# EAGLE schematic DIY_OpenEVSE_PLUS_30A (EAGLE 9.6.2)
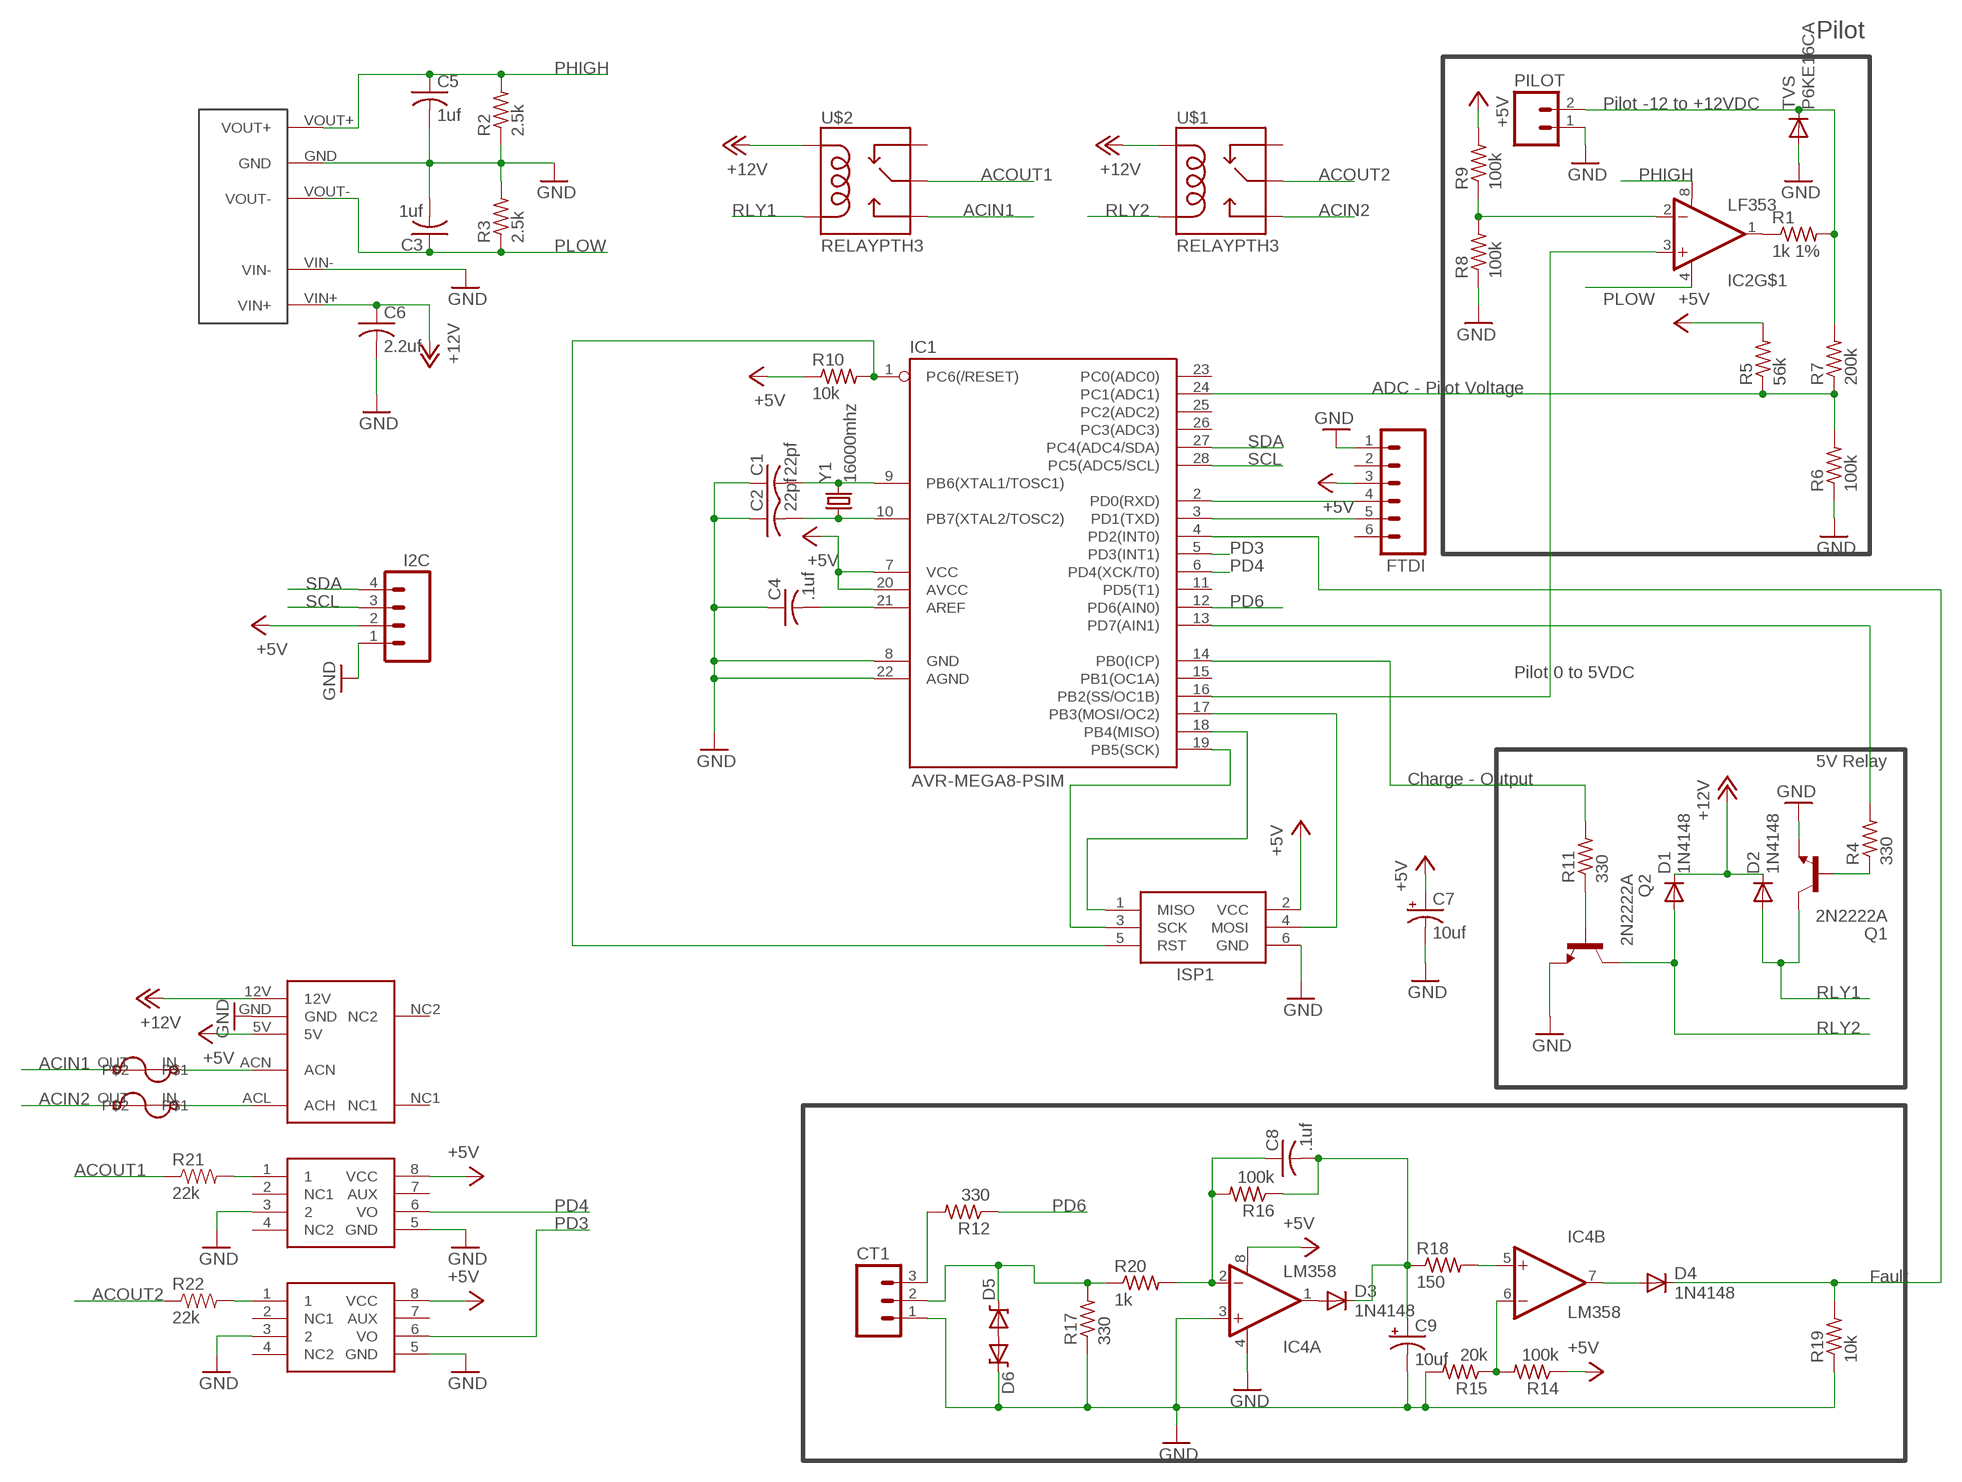
[diagram p0: schematic, sheet 1]

## Parts
C1  22pf  C-US025-024X044  [C025-024X044]
C2  22pf  C-US025-024X044  [C025-024X044]
C3  1uf  C-US025-024X044  [C025-024X044]
C4  .1uf  C-US025-024X044  [C025-024X044]
C5  1uf  C-US025-024X044  [C025-024X044]
C6  2.2uf  C-US025-024X044  [C025-024X044]
C7  10uf  CAP_POLPTH2  [CPOL-RADIAL-10UF-25V]
C8  .1uf  C-US025-024X044  [C025-024X044]
C9  10uf  CAP_POLPTH2  [CPOL-RADIAL-10UF-25V]
CT1  M03LOCK  [1X03_LOCK]
D1  1N4148  DIODE1N4148  [DIODE-1N4148]
D2  1N4148  DIODE1N4148  [DIODE-1N4148]
D3  1N4148  DIODE1N4148  [DIODE-1N4148]
D4  1N4148  DIODE1N4148  [DIODE-1N4148]
D5  DIODE-ZENERPTH  [DIODE-ZENER]
D6  DIODE-ZENERPTH  [DIODE-ZENER]
DCDC  D107E  DCDC_SIP  [DCDC_SIP]
FTDI  M06LOCK  [1X06_LOCK]
I2C  M04LOCK  [1X04_LOCK]
IC1  AVR-MEGA8-PSIM  [DIL28-3-SIMON]
IC2  LF353  LM358  [DIP08]
IC3  MID400  [DIP08]
IC4  LM358  OPAMP-DUALDIP  [DIP08]
IC5  MID400  [DIP08]
ISP1  AVRISP-6  [AVRISP]
PILOT  M025MM  [SCREWTERMINAL-5MM-2]
Q1  2N2222A  [TO18]
Q2  2N2222A  [TO18]
R1  1k 1%  R-US_0204/7  [0204/7]
R2  2.5k  R-US_0204/7  [0204/7]
R3  2.5k  R-US_0204/7  [0204/7]
R4  330  R-US_0204/7  [0204/7]
R5  56k  R-US_0204/7  [0204/7]
R6  100k  R-US_0204/7  [0204/7]
R7  200k  R-US_0204/7  [0204/7]
R8  100k  R-US_0204/7  [0204/7]
R9  100k  R-US_0204/7  [0204/7]
R10  10k  R-US_0204/7  [0204/7]
R11  330  R-US_0204/7  [0204/7]
R12  330  R-US_0204/7  [0204/7]
R14  100k  R-US_0204/7  [0204/7]
R15  20k  R-US_0204/7  [0204/7]
R16  100k  R-US_0204/7  [0204/7]
R17  330  R-US_0204/7  [0204/7]
R18  150  R-US_0204/7  [0204/7]
R19  10k  R-US_0204/7  [0204/7]
R20  1k  R-US_0204/7  [0204/7]
R21  22k  RESISTORPTH-1/4W  [AXIAL-0.4]
R22  22k  RESISTORPTH-1/4W  [AXIAL-0.4]
TVS  P6KE16CA  DIODEPTH  [DIODE-1N4001]
U$1  RELAYPTH3  [RELAY-T9A-2]
U$2  RELAYPTH3  [RELAY-T9A-2]
U$3  BEL1AFUSE  [BELFUSE1A]
U$4  MPM-04E-1205  [MPM-04E-1205]
U$5  BEL1AFUSE  [BELFUSE1A]
Y1  16000mhz  CRYSTALHC49UV  [HC49U-V]

## Nets
+5V: C7.1(+) FTDI.3 I2C.2 IC1.7(VCC) IC1.20(AVCC) IC3.8(VCC) IC4.8(A:V+) IC5.8(VCC) ISP1.2(VCC) R5.2 R9.2 R10.1 R14.1 U$4.5V
+12V: C6.1 D1.C D2.C DCDC.VIN+ U$1.COIL1 U$2.COIL1 U$4.12V
ACIN1: U$2.NO U$5.OUT
ACIN2: U$1.NO U$3.OUT
ACOUT1: R21.P$1 U$2.MAIN
ACOUT2: R22.P$1 U$1.MAIN
GND: C1.1 C2.1 C3.2 C4.1 C5.2 C6.2 C7.2(-) C9.2(-) CT1.1 D6.P$1(C) DCDC.GND DCDC.VIN- FTDI.1 I2C.1 IC1.8(GND) IC1.22(AGND) IC3.3 IC3.5(GND) IC4.3(A:+IN) IC4.4(A:V-) IC5.3 IC5.5(GND) ISP1.6(GND) PILOT.1 Q1.1(E) Q2.1(E) R2.1 R3.2 R6.1 R8.1 R15.2 R17.1 R19.1 TVS.A U$4.GND
N$1: CT1.3 R12.2
N$2: Q2.2(B) R11.1
N$3: PILOT.2 R1.2 R7.2 TVS.C
N$4: C1.2 IC1.9(PB6(XTAL1/TOSC1)) Y1.2
N$5: C2.2 IC1.10(PB7(XTAL2/TOSC2)) Y1.1
N$7: C4.2 IC1.21(AREF)
N$8: FTDI.5 IC1.3(PD1(TXD))
N$9: IC3.1 R21.P$2
N$10: IC2.2(-IN) R8.2 R9.1
N$11: IC2.1(OUT) R1.1
N$12: FTDI.4 IC1.2(PD0(RXD))
N$14: IC1.17(PB3(MOSI/OC2)) ISP1.4(MOSI)
N$15: IC1.19(PB5(SCK)) ISP1.3(SCK)
N$16: IC1.18(PB4(MISO)) ISP1.1(MISO)
N$17: IC5.1 R22.P$2
N$18: C8.1 IC4.2(A:-IN) R16.2 R20.2
N$19: IC4.5(B:+IN) R18.2
N$20: CT1.2 D5.P$1(C) R17.2 R20.1
N$21: D3.A IC4.1(A:OUT)
N$22: D5.P$2(A) D6.P$2(A)
N$23: C8.2 C9.1(+) D3.C R16.1 R18.1
N$24: IC4.6(B:-IN) R14.2 R15.1
N$25: D4.A IC4.7(B:OUT)
N$27: U$3.IN U$4.ACL(ACH)
N$28: D4.C IC1.4(PD2(INT0)) R19.2
N$30: U$4.ACN U$5.IN
N$31: Q1.2(B) R4.1
N$33: IC1.13(PD7(AIN1)) R4.2
N$34: IC1.14(PB0(ICP)) R11.2
N$53: IC1.24(PC1(ADC1)) R5.1 R6.2 R7.1
PD3: IC1.5(PD3(INT1)) IC5.6(VO)
PD4: IC1.6(PD4(XCK/T0)) IC3.6(VO)
PD6: IC1.12(PD6(AIN0)) R12.1
PHIGH: C5.1 DCDC.VOUT+ IC2.8(V+) R2.2
PLOW: C3.1 DCDC.VOUT- IC2.4(V-) R3.1
RLY1: D2.A Q1.3(C) U$2.COIL2
RLY2: D1.A Q2.3(C) U$1.COIL2
RST: IC1.1(PC6(/RESET)) ISP1.5(RST) R10.2
S$2: IC1.16(PB2(SS/OC1B)) IC2.3(+IN)
SCL: I2C.3 IC1.28(PC5(ADC5/SCL))
SDA: I2C.4 IC1.27(PC4(ADC4/SDA))
Unconnected: FTDI.2 FTDI.6 IC1.11(PD5(T1)) IC1.15(PB1(OC1A)) IC1.23(PC0(ADC0)) IC1.25(PC2(ADC2)) IC1.26(PC3(ADC3)) IC2.5(+IN) IC2.6(-IN) IC2.7(OUT) IC3.2(NC1) IC3.4(NC2) IC3.7(AUX) IC5.2(NC1) IC5.4(NC2) IC5.7(AUX) U$1.NC U$2.NC U$4.NC1 U$4.NC2

## Notes on the sheet
- Pilot
- Pilot -12 to +12VDC
- ADC - Pilot Voltage
- Pilot 0 to 5VDC
- 5V Relay
- Charge - Output
- Fault

## Library data of the parts
C1-C6 C8 = adafruit:C-US: CAPACITOR, American symbol
C7 C9 = SparkFun:CAP_POL: Capacitor Polarized These are standard SMD and PTH capacitors. Normally 10uF, 47uF, and 100uF in electrolytic and tantalum varieties. Always verify the external diameter of the through hole cap, it varies with capacity, voltage, and manufacturer. The EIA devices should be standard.
CT1 = SparkFun:M03: Header 3 Standard 3-pin 0.1" header. Use with straight break away headers (SKU : PRT-00116), right angle break away headers (PRT-00553), swiss pins (PRT-00743), machine pins (PRT-00117), and female headers (PRT-00115). Molex polarized connector foot print use with SKU : PRT-08232 with associated crimp pins and housings.
D1-D4 TVS = SparkFun:DIODE: Diode These are standard reverse protection diodes and small signal diodes. SMA package can handle up to about 1A. SOD-323 can handle about 200mA. What the SOD-323 package when ordering, there are some mfgs out there that are 5-pin packages.
D5 D6 = SparkFun:DIODE-ZENER: Zener Diode Production Part - 8199 3.4V Zener Voltage
DCDC = Qxd:DCDC_SIP
FTDI = SparkFun:M06: Header 6 Standard 6-pin 0.1" header. Use with straight break away headers (SKU : PRT-00116), right angle break away headers (PRT-00553), swiss pins (PRT-00743), machine pins (PRT-00117), and female headers (PRT-00115). Molex polarized connector foot print use with SKU : PRT-08094 with associated crimp pins and housings. NOTES ON THE VARIANTS LOCK and LOCK_LONGPADS... This footprint was designed to help hold the alignment of a through-hole component (i.e. 6-pin header) while soldering it into place. You may notice that each hole has been shifted either up or down by 0.005 of an inch from it's more standard position (which is a perfectly straight line). This slight alteration caused the pins (the squares in the middle) to touch the edges of the holes. Because they are alternating, it causes a "brace" to hold the component in place. 0.005 has proven to be the perfect amount of "off-center" position when using our standard breakaway headers. Although looks a little odd when you look at the bare footprint, once you have a header in there, the alteration is very hard to notice. Also, if you push a header all the way into place, it is covered up entirely on the bottom side. This idea of altering the position of holes to aid alignment will be further integrated into the Sparkfun Library for other footprints. It can help hold any component with 3 or more connection pins.
I2C = SparkFun:M04: Header 4 Standard 4-pin 0.1" header. Use with straight break away headers (SKU : PRT-00116), right angle break away headers (PRT-00553), swiss pins (PRT-00743), machine pins (PRT-00117), and female headers (PRT-00115). Molex polarized connector foot print use with SKU : PRT-08231 with associated crimp pins and housings.
IC1 = SparkFun:AVR-MEGA8-P: MICROCONTROLLER 8 Kbytes FLASH 1 kbytes SRAM 512 bytes EEPROM USART 4-channel 10 bit ADC 2-channel 8 bit ADC
IC2 = SparkFun:LM358
IC3 IC5 = SparkFun:MID400
IC4 = SparkFun:OPAMP-DUAL: Operational Amplifier
ISP1 = adafruit:AVRISP: AVR ISP HEADER Standard 6 pin header for AVR programming
PILOT = SparkFun:M02: Header 2 Standard 2-pin 0.1" header. Use with straight break away headers (SKU : PRT-00116), right angle break away headers (PRT-00553), swiss pins (PRT-00743), machine pins (PRT-00117), and female headers (PRT-00115). Molex polarized connector foot print use with SKU : PRT-08233 with associated crimp pins and housings.
Q1 Q2 = transistor-npn:2N2222*: NPN Transistor
R1-R12 R14-R20 = adafruit:R-US_: RESISTOR, American symbol
R21 R22 = SparkFun:RESISTOR: Resistor Basic schematic elements and footprints for 0603, 1206, and PTH resistors.
U$1 U$2 = SparkFun:RELAY
U$3 U$5 = Qxd:BEL1AFUSE
U$4 = Qxd:MPM-04E-1205
Y1 = SparkFun:CRYSTAL: Crystals Various standard crystals. Proven footprints. Spark Fun Electronics SKU : COM-00534